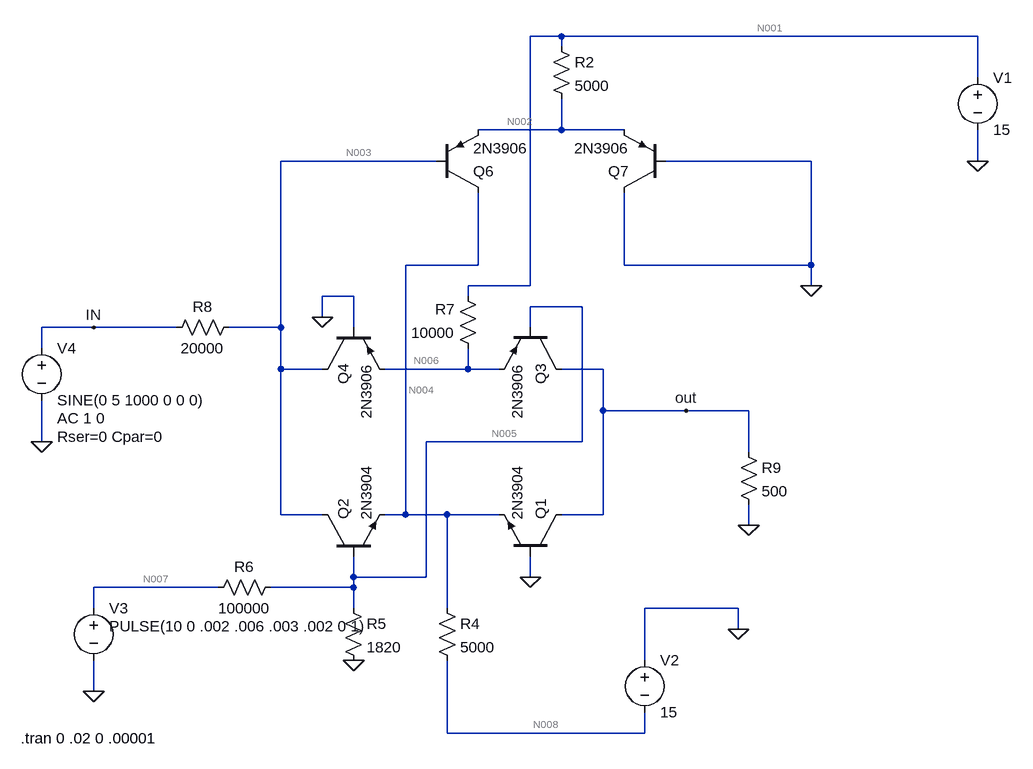
[diagram p0: schematic bmcel6tranny.asc]
bmcel6tranny.asc, the LTspice schematic file:
Version 4
SHEET 1 1292 680
WIRE 592 -528 544 -528
WIRE 1232 -528 592 -528
WIRE 592 -512 592 -528
WIRE 1232 -464 1232 -528
WIRE 592 -384 592 -432
WIRE 592 -384 464 -384
WIRE 688 -384 592 -384
WIRE 400 -336 160 -336
WIRE 976 -336 752 -336
WIRE 1232 -336 1232 -384
WIRE 464 -176 464 -288
WIRE 464 -176 352 -176
WIRE 688 -176 688 -288
WIRE 976 -176 976 -336
WIRE 976 -176 688 -176
WIRE 544 -144 544 -528
WIRE 544 -144 448 -144
WIRE 976 -144 976 -176
WIRE 272 -128 224 -128
WIRE 448 -128 448 -144
WIRE 624 -112 544 -112
WIRE 224 -96 224 -128
WIRE -128 -80 -208 -80
WIRE 0 -80 -128 -80
WIRE 160 -80 160 -336
WIRE 160 -80 80 -80
WIRE 272 -80 272 -128
WIRE 544 -80 544 -112
WIRE -208 -48 -208 -80
WIRE 160 -16 160 -80
WIRE 224 -16 160 -16
WIRE 448 -16 448 -48
WIRE 448 -16 320 -16
WIRE 496 -16 448 -16
WIRE 656 -16 592 -16
WIRE 656 48 656 -16
WIRE 784 48 656 48
WIRE 880 48 784 48
WIRE -208 96 -208 32
WIRE 624 96 624 -112
WIRE 624 96 384 96
WIRE 880 112 880 48
WIRE 160 208 160 -16
WIRE 224 208 160 208
WIRE 352 208 352 -176
WIRE 352 208 320 208
WIRE 416 208 352 208
WIRE 496 208 416 208
WIRE 656 208 656 48
WIRE 656 208 592 208
WIRE 880 224 880 192
WIRE 272 304 272 272
WIRE 384 304 384 96
WIRE 384 304 272 304
WIRE 544 304 544 272
WIRE 64 320 -128 320
WIRE 272 320 272 304
WIRE 272 320 144 320
WIRE -128 352 -128 320
WIRE 272 352 272 320
WIRE 416 352 416 208
WIRE 864 352 720 352
WIRE 864 384 864 352
WIRE 720 432 720 352
WIRE -128 480 -128 432
WIRE 416 544 416 432
WIRE 720 544 720 512
WIRE 720 544 416 544
FLAG 976 -144 0
FLAG 272 432 0
FLAG 224 -96 0
FLAG 544 304 0
FLAG 880 224 0
FLAG -208 96 0
FLAG -128 480 0
FLAG 864 384 0
FLAG 1232 -336 0
FLAG -128 -80 IN
FLAG 784 48 out
SYMBOL npn 592 272 M270
SYMATTR InstName Q1
SYMATTR Value 2N3904
SYMBOL npn 224 272 R270
SYMATTR InstName Q2
SYMATTR Value 2N3904
SYMBOL pnp 592 -80 R90
SYMATTR InstName Q3
SYMATTR Value 2N3906
SYMBOL pnp 224 -80 M90
SYMATTR InstName Q4
SYMATTR Value 2N3906
SYMBOL pnp 400 -288 M180
SYMATTR InstName Q6
SYMATTR Value 2N3906
SYMBOL pnp 752 -288 R180
SYMATTR InstName Q7
SYMATTR Value 2N3906
SYMBOL res 576 -528 R0
SYMATTR InstName R2
SYMATTR Value 5000
SYMBOL res 400 336 R0
SYMATTR InstName R4
SYMATTR Value 5000
SYMBOL res 256 336 R0
SYMATTR InstName R5
SYMATTR Value 1820
SYMBOL res 160 304 R90
WINDOW 0 0 56 VBottom 2
WINDOW 3 32 56 VTop 2
SYMATTR InstName R6
SYMATTR Value 100000
SYMBOL res 464 -32 R180
WINDOW 0 36 76 Left 2
WINDOW 3 36 40 Left 2
SYMATTR InstName R7
SYMATTR Value 10000
SYMBOL res 96 -96 R90
WINDOW 0 0 56 VBottom 2
WINDOW 3 32 56 VTop 2
SYMATTR InstName R8
SYMATTR Value 20000
SYMBOL res 864 96 R0
SYMATTR InstName R9
SYMATTR Value 500
SYMBOL voltage 1232 -480 R0
WINDOW 123 0 0 Left 2
WINDOW 39 0 0 Left 2
SYMATTR InstName V1
SYMATTR Value 15
SYMBOL voltage 720 416 R0
WINDOW 123 0 0 Left 2
WINDOW 39 0 0 Left 2
SYMATTR InstName V2
SYMATTR Value 15
SYMBOL voltage -128 336 R0
WINDOW 123 0 0 Left 2
WINDOW 39 0 0 Left 2
WINDOW 3 24 44 Left 2
SYMATTR Value PULSE(10 0 .002 .006 .003 .002 0 1)
SYMATTR InstName V3
SYMBOL voltage -208 -64 R0
WINDOW 123 24 124 Left 2
WINDOW 39 24 152 Left 2
SYMATTR Value2 AC 1 0
SYMATTR SpiceLine Rser=0 Cpar=0
SYMATTR InstName V4
SYMATTR Value SINE(0 5 1000 0 0 0)
TEXT -240 552 Left 2 !.tran 0 .02 0 .00001

The netlist it stands for:
* bmcel6tranny.asc
Q1 out 0 N004 0 2N3904
Q2 N003 N005 N004 0 2N3904
Q3 out N005 N006 0 2N3906
Q4 N003 0 N006 0 2N3906
Q6 N004 N003 N002 0 2N3906
Q7 0 0 N002 0 2N3906
R2 N001 N002 5000
R4 N004 N008 5000
R5 N005 0 1820
R6 N005 N007 100000
R7 N006 N001 10000
R8 N003 IN 20000
R9 out 0 500
V1 N001 0 15
V2 0 N008 15
V3 N007 0 PULSE(10 0 .002 .006 .003 .002 0 1)
V4 IN 0 SINE(0 5 1000 0 0 0) AC 1 0 Rser=0 Cpar=0
.model NPN NPN
.model PNP PNP
.lib standard.bjt
.tran 0 .02 0 .00001
.backanno
.end

* Results of the author's LTspice run, read from the files saved beside the schematic
* Operating Point, zero values left out:
*   V(out) = -3.435 µV
*   V(n004) = -494.6 mV
*   V(n003) = -1.199 mV
*   V(n005) = 170.2 mV
*   V(n006) = 664.6 mV
*   V(n002) = 664 mV
*   V(n001) = 15 V
*   V(n008) = -15 V
*   V(n007) = 10 V
*   Ic(Q7) = -1.39 mA
*   Ib(Q7) = -6.976 µA
*   Ie(Q7) = 1.397 mA
*   Ic(Q6) = -1.463 mA
*   Ib(Q6) = -7.303 µA
*   Ie(Q6) = 1.47 mA
*   Ic(Q4) = -1.424 mA
*   Ib(Q4) = -7.147 µA
*   Ie(Q4) = 1.432 mA
*   Ic(Q3) = -2.009 µA
*   Ib(Q3) = -10.03 nA
*   Ie(Q3) = 2.019 µA
*   Ic(Q2) = 1.432 mA
*   Ib(Q2) = 4.798 µA
*   Ie(Q2) = -1.437 mA
*   Ic(Q1) = 2.016 µA
*   Ib(Q1) = 6.722 nA
*   Ie(Q1) = -2.023 µA
*   I(R9) = -6.87 nA
*   I(R8) = -59.95 nA
*   I(R7) = -1.434 mA
*   I(R6) = -98.3 µA
*   I(R5) = 93.51 µA
*   I(R4) = 2.901 mA
*   I(R2) = 2.867 mA
*   I(V4) = -59.95 nA
*   I(V3) = -98.3 µA
*   I(V2) = -2.901 mA
*   I(V1) = -4.301 mA
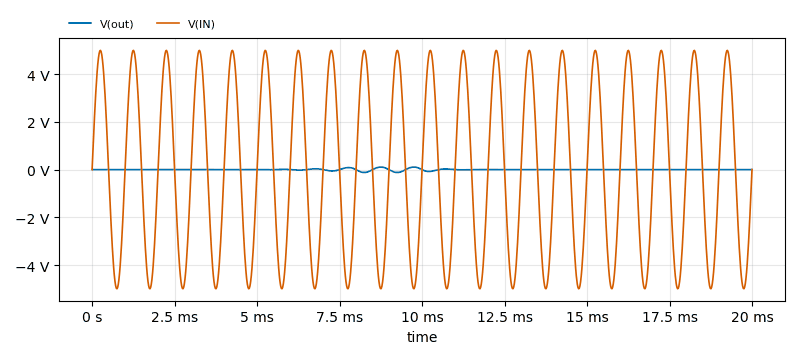
[diagram p1: Transient Analysis of bmcel6tranny.asc, plotted from the saved traces]
* Transient Analysis, 1 run:
*   V(out): min -123 mV, max 106.2 mV, average -973.6 µV, rms 30.12 mV, last -3.449 µV
*   V(IN): min -4.994 V, max 4.994 V, average -47.23 µV, rms 3.531 V, last 0 V